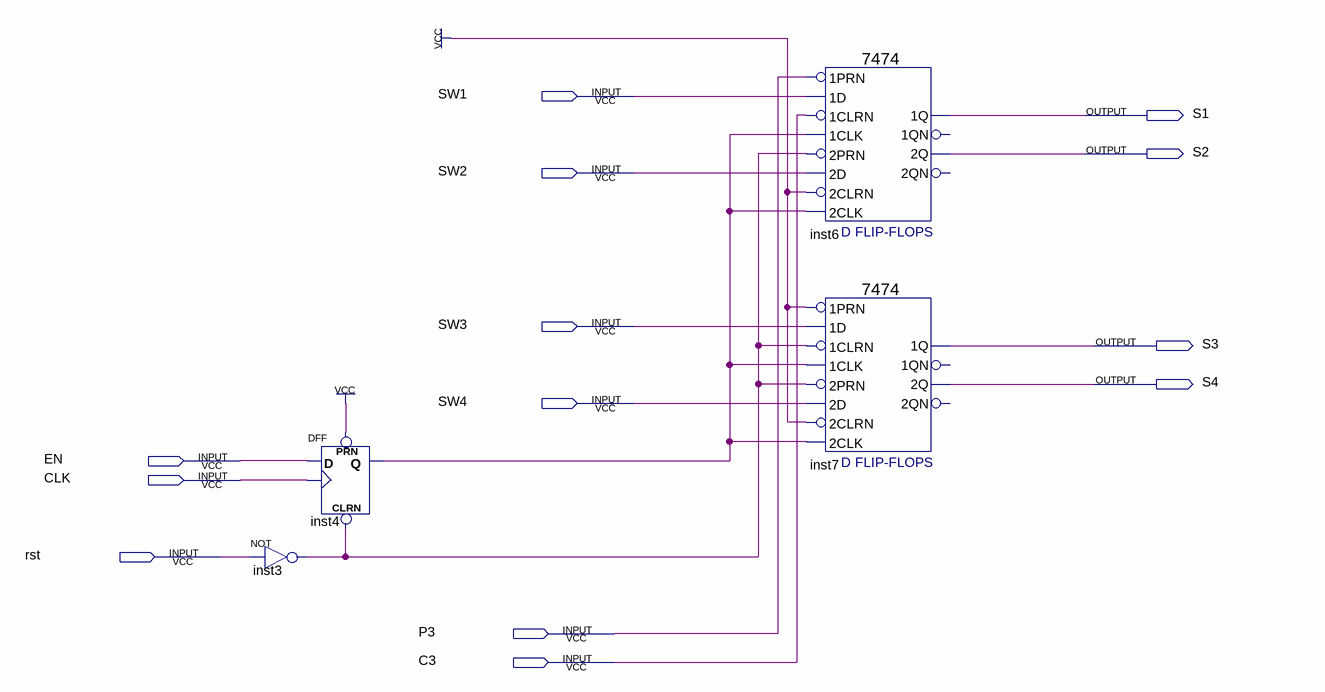
[diagram p0: schematic sheet]
// Quartus schematic Reg3.bdf as structural Verilog: 4 symbols, 13 pins
module Reg3 (
  input  SW1,
  input  SW2,
  input  SW3,
  input  SW4,
  input  EN,
  input  CLK,
  input  rst,
  input  P3,
  input  C3,
  output S1,
  output S2,
  output S3,
  output S4
);

  wire inst3_out, inst4_q;

  not inst3 (inst3_out, rst);
  DFF inst4 (.CLRN(inst3_out), .CLK(CLK), .D(EN), .PRN(1'b1), .Q(inst4_q));
  \7474  inst6 (
    .\2D (SW2), .\2PRN (inst3_out), .\1CLK (inst4_q), .\1D (SW1), .\1PRN (P3), .\2CLK (inst4_q),
    .\2CLRN (1'b1), .\1CLRN (C3), .\2Q (S2), .\1Q (S1));  // open: 1QN, 2QN
  \7474  inst7 (
    .\2D (SW4), .\2PRN (inst3_out), .\1CLK (inst4_q), .\1D (SW3), .\1PRN (1'b1), .\2CLK (inst4_q),
    .\2CLRN (1'b1), .\1CLRN (inst3_out), .\2Q (S4), .\1Q (S3));  // open: 1QN, 2QN
endmodule
